# Altium project LoRasPi_02.PrjPcb
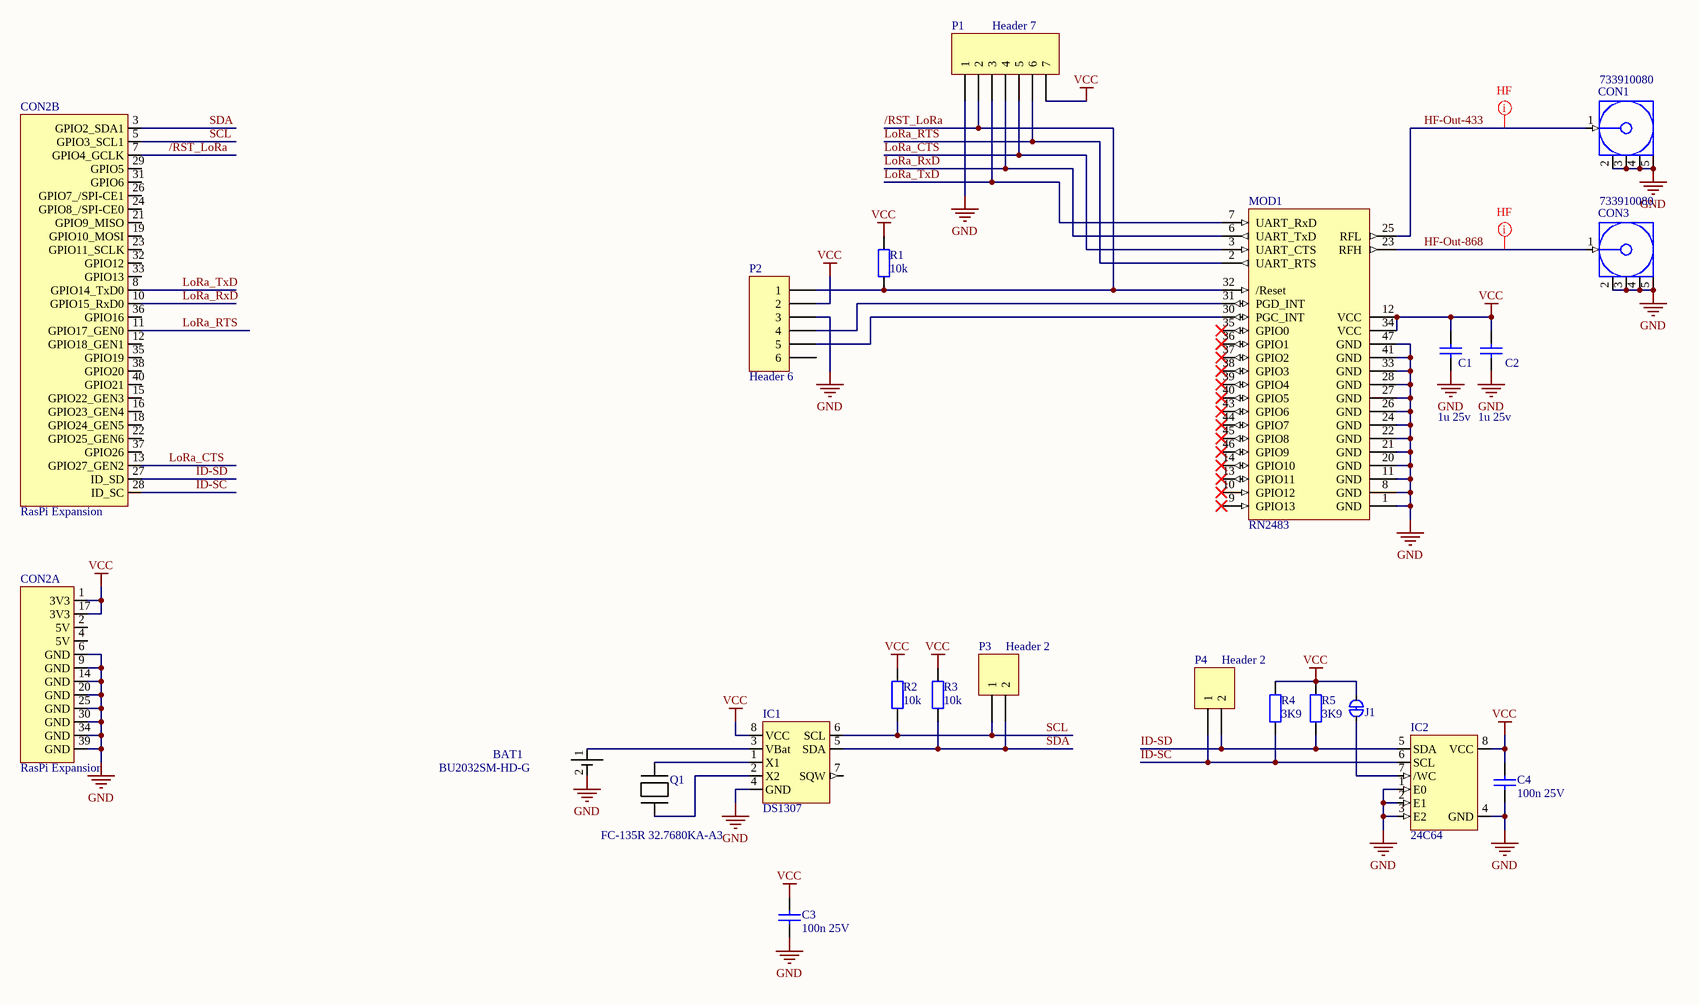
[diagram p0: LoRasPi_02.SchDoc]
1 sheet, 22 parts. Net scope: global (net labels, ports and power ports of the same name join across sheets).
Board file: LoRasPi_02.PcbDoc

## Sheet LoRasPi_02.SchDoc
size A3

### Parts
BAT1  BU2032SM-HD-G  [BU2032SM-HD-G]
C1  1u 25v  [C-0603-H]
C2  1u 25v  [C-0603-H]
C3  100n 25V  [C-0603-H]
C4  100n 25V  [C-0603-H]
CON1  733910080  [733910080]
CON2  RasPi Expansion  [RasPi Expansion]  (parts A,B of 2)
CON3  733910080  [733910080]
IC1  DS1307  [SOIC8]
IC2  24C64  [TSSOP8]
J1  Lötbrücke_kl  [Solderbridge_kl]  (value not drawn)
MOD1  RN2483  [RN2483]
P1  Header 7  [HDR1X7]
P2  Header 6  [HDR1X6]
P3  Header 2  [HDR1X2]
P4  Header 2  [HDR1X2]
Q1  FC-135R 32.7680KA-A3  [FC-135]
R1  10k  [R-0603-H]
R2  10k  [R-0603-H]
R3  10k  [R-0603-H]
R4  3K9  [R-0603-M]
R5  3K9  [R-0603-M]

### Nets
GND: BAT1.2(-) C1.1 C2.1 C3.1 C4.1 CON1.2(GND) CON1.3(GND) CON1.4(GND) CON1.5(GND) CON2.6(GND) CON2.9(GND) CON2.14(GND) CON2.20(GND) CON2.25(GND) CON2.30(GND) CON2.34(GND) CON2.39(GND) CON3.2(GND) CON3.3(GND) CON3.4(GND) CON3.5(GND) IC1.4(GND) IC2.1(E0) IC2.2(E1) IC2.3(E2) IC2.4(GND) MOD1.1(GND) MOD1.8(GND) MOD1.11(GND) MOD1.20(GND) MOD1.21(GND) MOD1.22(GND) MOD1.24(GND) MOD1.26(GND) MOD1.27(GND) MOD1.28(GND) MOD1.33(GND) MOD1.41(GND) MOD1.47(GND) P1.1 P2.3
VCC: C1.2 C2.2 C3.2 C4.2 CON2.1(3V3) CON2.17(3V3) IC1.8(VCC) IC2.8(VCC) J1.1 MOD1.12(VCC) MOD1.34(VCC) P1.7 P2.2 R1.2 R2.2 R3.2 R4.2 R5.2
/RST_LoRa: CON2.7(GPIO4_GCLK) MOD1.32(/Reset) P1.2 P2.1 R1.1
HF-Out-433: CON1.1(Signal) MOD1.25(RFL)
HF-Out-868: CON3.1(Signal) MOD1.23(RFH)
ID-SC: CON2.28(ID_SC) IC2.6(SCL) P4.1 R4.1
ID-SD: CON2.27(ID_SD) IC2.5(SDA) P4.2 R5.1
LoRa_CTS: CON2.13(GPIO27_GEN2) MOD1.3(UART_CTS) P1.5
LoRa_RTS: CON2.11(GPIO17_GEN0) MOD1.2(UART_RTS) P1.6
LoRa_RxD: CON2.10(GPIO15_RxD0) MOD1.6(UART_TxD) P1.4
LoRa_TxD: CON2.8(GPIO14_TxD0) MOD1.7(UART_RxD) P1.3
SCL: CON2.5(GPIO3_SCL1) IC1.6(SCL) P3.1 R2.1
SDA: CON2.3(GPIO2_SDA1) IC1.5(SDA) P3.2 R3.1
NetBAT1_1: BAT1.1(+) IC1.3(VBat)
NetIC1_1: IC1.1(X1) Q1.2
NetIC1_2: IC1.2(X2) Q1.1
NetIC2_7: IC2.7(/WC) J1.2
NetMOD1_30: MOD1.30(PGC_INT) P2.5
NetMOD1_31: MOD1.31(PGD_INT) P2.4

Not connected (* = marked no-connect by the designer): CON2 2(5V) 4(5V) 12(GPIO18_GEN1) 15(GPIO22_GEN3) 16(GPIO23_GEN4) 18(GPIO24_GEN5) 19(GPIO10_MOSI) 21(GPIO9_MISO) 22(GPIO25_GEN6) 23(GPIO11_SCLK) 24(GPIO8_/SPI-CE0) 26(GPIO7_/SPI-CE1) 29(GPIO5) 31(GPIO6) 32(GPIO12) 33(GPIO13) 35(GPIO19) 36(GPIO16) 37(GPIO26) 38(GPIO20) 40(GPIO21); IC1 7(SQW); MOD1 9(GPIO13)* 10(GPIO12)* 13(GPIO11)* 14(GPIO10)* 35(GPIO0)* 36(GPIO1)* 37(GPIO2)* 38(GPIO3)* 39(GPIO4)* 40(GPIO5)* 43(GPIO6)* 44(GPIO7)* 45(GPIO8)* 46(GPIO9)*; P2 6

### Layout directives
net class HF; rule Width Constraint [Pref Width = 0.293mm    Min Width = 0.254mm    Max Width = 0.293mm]: HF-Out-433, HF-Out-868

### Library data of the parts
BAT1 = BU2032SM-HD-G: Batteriehalter CR2032
C1 C2 = C-0603-1u-25V: Capacitor 1uF 25V; Supplier 1: Mouser; Supplier Part Number 1: 80-C0603C105K3R
C3 C4 = C-0603-100n-25V: Capacitor 100n 25V; Supplier 1: Mouser; Supplier Part Number 1: 80-C0603C104K3R
CON1 CON3 = 733910080: SMA Connector THT gewinkelt; ComponentLink1Description: New link; ComponentLink1URL: *; Supplier 1: Digi-Key; Supplier 2: Farnell; Supplier 3: Mouser; Supplier 4: Arrow; Supplier Part Number 1: WM4088-ND; Supplier Part Number 2: 2579835; Supplier Part Number 3: 538-73391-0080; Supplier Part Number 4: 73391-0080
CON2 = RasPi Expansion_2: Raspberry Pi, 40P Expansion port
IC1 = DS1307: RTC, I2C, 64x8
IC2 = M24C64 DW: EEPROM 64KBit I2C TSSOP8
J1 = Solderbridge_kl: Lötbrücke klein
MOD1 = RN2483: LoRa Modul; Supplier 1: Digi-Key; Supplier 2: Farnell; Supplier 3: Mouser; Supplier Part Number 1: RN2483A-I/RM105-ND; Supplier Part Number 2: 2932051; Supplier Part Number 3: 579-RN2483A-I/RM105
P1 = Header 7: Header, 7-Pin; LatestRevisionDate: 17-Jul-2002; LatestRevisionNote: Re-released for DXP Platform.; Publisher: Altium Limited
P2 = Header 6: Header, 6-Pin; LatestRevisionDate: 17-Jul-2002; LatestRevisionNote: Re-released for DXP Platform.; Publisher: Altium Limited
P3 P4 = Header 2: Header, 2-Pin; LatestRevisionDate: 17-Jul-2002; LatestRevisionNote: Re-released for DXP Platform.; Publisher: Altium Limited
Q1 = Xtal FC-135 32.7680KA-A3: 32,768KHz; Supplier 1: Digi-Key; Supplier 2: Mouser; Supplier Part Number 1: SE2413CT-ND; Supplier Part Number 2: 732-FC-13532.768KAAC
R1-R3 = R-0603-10k: Resistor 10k; Supplier 1: Mouser; Supplier Part Number 1: 71-CRCW0603-10K-E3
R4 R5 = R-0603-3k9: Resistor 3k9